# EAGLE schematic PM-BAT v0.4-35X22.86 (EAGLE 9.6.2)
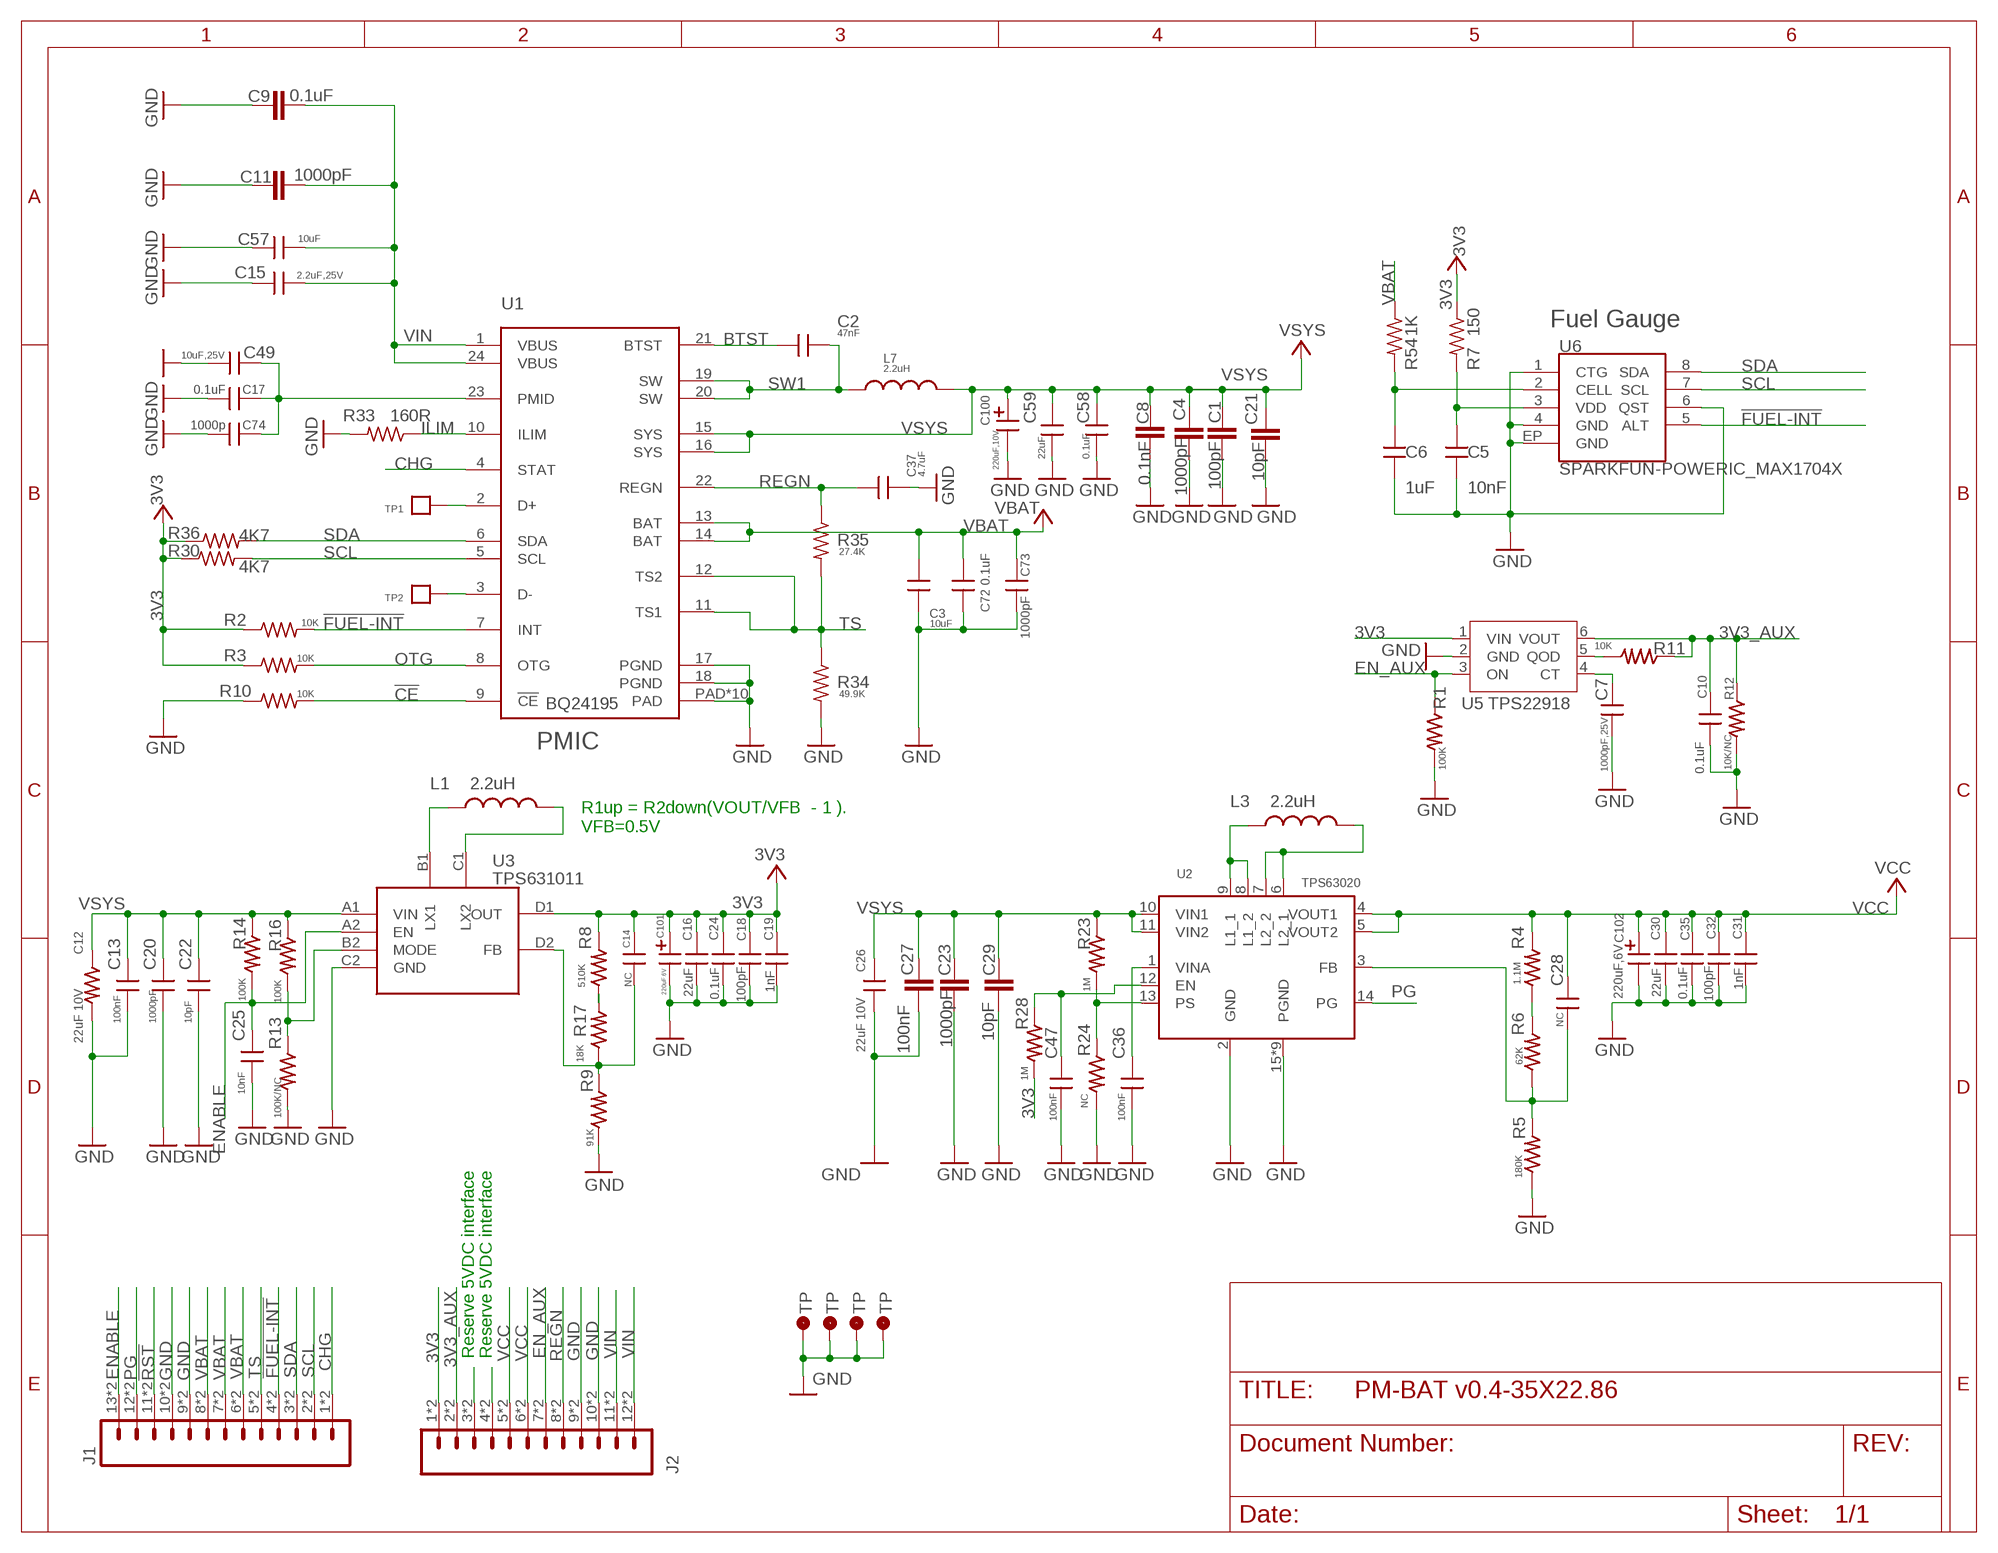
[diagram p0: schematic, sheet 1]

## Parts
C1  100pF  CAP_1  [C0402_B]
C2  47nF  CAP0402  [C-0402]
C3  10uF  CAPC0805  [C0805]
C4  1000pF  CAP_1  [C0402_B]
C5  10nF  CAP0402A  [C0402]
C6  1uF  CAP0402A  [C0402]
C7  1000pF,25V  CAP0402A  [C0402]
C8  0.1nF  CAP_1  [C0402_B]
C9  0.1uF  CAP_1  [C0402_B]
C10  0.1uF  CAPC0201-N  [C0201-N]
C11  1000pF  CAP_1  [C0402_B]
C12  22uF 10V  RESR0603A  [R-0603A]
C13  100nF  CAPC0201-N  [C0201-N]
C14  NC  CAPC0201-N  [C0201-N]
C15  2.2uF,25V  CAP0603A  [C-0603A]
C16  22uF  CAP0603A  [C-0603A]
C17  0.1uF  CAP0402A  [C0402]
C18  100pF  CAP0402A  [C0402]
C19  1nF  CAP0402A  [C0402]
C20  1000pF  CAPC0201-N  [C0201-N]
C21  10pF  CAP_1  [C0402_B]
C22  10pF  CAPC0201-N  [C0201-N]
C23  1000pF  CAP_1  [C0402_B]
C24  0.1uF  CAP0402A  [C0402]
C25  10nF  CAPC0201-N  [C0201-N]
C26  22uF 10V  CAPC0603  [C0603]
C27  100nF  CAP_1  [C0402_B]
C28  NC  CAPC0201-N  [C0201-N]
C29  10pF  CAP_1  [C0402_B]
C30  22uF  CAP0603A  [C-0603A]
C31  1nF  CAP0402A  [C0402]
C32  100pF  CAP0402A  [C0402]
C35  0.1uF  CAP0402A  [C0402]
C36  100nF  CAPC0201-N  [C0201-N]
C37  4.7uF  CAP0402A  [C0402]
C47  100nF  CAPC0201-N  [C0201-N]
C49  10uF,25V  CAP0603A  [C-0603A]
C57  10uF  CAP0603A  [C-0603A]
C58  0.1uF  CAP0402A  [C0402]
C59  22uF  CAPC0603  [C0603]
C72  0.1uF  CAP0402  [C-0402]
C73  1000pF  CAP0402  [C-0402]
C74  1000p  CAP0402  [C-0402]
C100  220uF,10V  CAP-ECASE_B  [CASE-B]
C101  220uF.6V  CAP-ECASE_B  [CASE-B]
C102  220uF,6V  CAP-ECASE_B  [CASE-B]
J1  M13PTH-CST-R  [1X13-CASTELLATED]
J2  M12PTH-CST-R  [1X12-CASTELLATED]
L1  2.2uH  INDUCTOR-SPARKFUNINDUCTOR-2520  [INDUCTOR-2520]
L3  2.2uH  INDUCTOR-SPARKFUNINDUCTOR-2520  [INDUCTOR-2520]
L7  2.2uH  INDUCTORI  [INDUCTOR-4040]
R1  100K  RESR0201-N  [R0201-N]
R2  10K  R-US_  [R0402_B]
R3  10K  R-US_  [R0402_B]
R4  1.1M  RESR0201-N  [R0201-N]
R5  180K  RESR0201-N  [R0201-N]
R6  62K  RESR0201-N  [R0201-N]
R7  150  R-US_  [R0402_B]
R8  510K  RESR0201-N  [R0201-N]
R9  91K  RESR0201-N  [R0201-N]
R10  10K  R-US_  [R0402_B]
R11  10K  RESR0201-N  [R0201-N]
R12  10K/NC  RESR0201-N  [R0201-N]
R13  100K/NC  RESR0201-N  [R0201-N]
R14  100K  RESR0201-N  [R0201-N]
R16  100K  RESR0201-N  [R0201-N]
R17  18K  RESR0201-N  [R0201-N]
R23  1M  RESR0201-N  [R0201-N]
R24  NC  RESR0201-N  [R0201-N]
R28  1M  RESR0201-N  [R0201-N]
R30  4K7  R-US_  [R0402_B]
R33  160R  R-US_  [R0402_B]
R34  49.9K  R-US_  [R0402_B]
R35  27.4K  R-US_  [R0402_B]
R36  4K7  R-US_  [R0402_B]
R54  1K  R-US_  [R0402_B]
TP1  TP1311MM  [TP-1311MM]
TP2  TP1311MM  [TP-1311MM]
U1  BQ24195  ELECTRON_BQ24298RTWR  [ELECTRON_QFN24]
U2  TPS63020  [TPS63020]
U3  TPS631011  TPS631010  [DSBGA]
U5  TPS22918  [SOT-23-6]
U6  SPARKFUN-POWERIC_MAX1704X  [SPARKFUN-POWERIC_TDFN-8]
U$1  TP  [TP_2.33X1.37]
U$2  TP  [TP_2.33X1.37]
U$4  TP  [TP_2.33X1.37]
U$5  TP  [TP_2.33X1.37]

## Nets
3V3: C14.1 C16.1 C18.1 C19.1 C24.1 C101.P$1 J2.1 J2.@1 R2.1 R3.1 R7.1 R8.2 R28.2 R30.1 R36.1 U3.D1(OUT) U5.1(VIN)
3V3_AUX: C10.1 J2.2 J2.@2 R11.1 R12.1 U5.6(VOUT)
!CE: R10.2 U1.9(!CE)
!FUEL-INT: J1.4 J1.@4 R2.2 U1.7(INT) U6.5(ALT)
!RST: J1.11 J1.@11
BTST: C2.1 U1.21(BTST)
CHG: J1.1 J1.@1 U1.4(STAT)
EN_AUX: J2.7 J2.@7 R1.1 U5.3(ON)
ENABLE: C25.1 J1.13 J1.@13 R14.2 U3.A2(EN)
GND: C1.1 C3.2 C4.1 C5.2 C6.2 C7.2 C8.1 C9.1 C10.2 C11.1 C12.2 C13.2 C15.2 C16.2 C17.1 C18.2 C19.2 C20.2 C21.1 C22.2 C23.1 C24.2 C25.2 C26.2 C27.1 C29.1 C30.2 C31.2 C32.2 C35.2 C36.2 C37.2 C47.2 C49.2 C57.2 C58.2 C59.2 C72.2 C73.2 C74.1 C100.P$2 C101.P$2 C102.P$2 J1.9 J1.10 J1.@9 J1.@10 J2.9 J2.10 J2.@9 J2.@10 R1.2 R5.1 R9.1 R10.1 R12.2 R13.2 R24.2 R33.2 R34.2 U1.17(PGND) U1.18(PGND) U1.PAD U1.PAD@1(PAD) U1.PAD@2(PAD) U1.PAD@3(PAD) U1.PAD@4(PAD) U1.PAD@5(PAD) U1.PAD@6(PAD) U1.PAD@7(PAD) U1.PAD@8(PAD) U1.PAD@9(PAD) U2.2(GND) U2.15(PGND) U2.16(PGND) U2.17(PGND) U2.18(PGND) U2.19(PGND) U2.20(PGND) U2.21(PGND) U2.22(PGND) U2.23(PGND) U3.C2(GND) U5.2(GND) U6.1(CTG) U6.4(GND) U6.6(QST) U6.EP(GND) U$1.1(TP) U$2.1(TP) U$4.1(TP) U$5.1(TP)
ILIM: R33.1 U1.10(ILIM)
N$1: J2.3 J2.@3
N$2: C17.2 C49.1 C74.2 U1.23(PMID)
N$4: TP2.P$1 U1.3(D-)
N$5: C14.2 R9.2 R17.1 U3.D2(FB)
N$6: C28.2 R5.2 R6.1 U2.3(FB)
N$7: TP1.P$1 U1.2(D+)
N$8: R8.1 R17.2
N$9: R4.1 R6.2
N$10: J2.4 J2.@4
N$11: L3.1 U2.8(L1_2) U2.9(L1_1)
N$12: L1.1 U3.B1(LX1)
N$15: R13.1 R16.2 U3.B2(MODE)
N$16: L3.2 U2.6(L2_1) U2.7(L2_2)
N$17: L1.2 U3.C1(LX2)
N$18: C7.1 U5.4(CT)
N$19: C36.1 U2.1(VINA)
N$20: R11.2 U5.5(QOD)
N$21: C47.1 R28.1 U2.12(EN)
N$22: R23.2 R24.1 U2.13(PS)
N$48: C5.1 R7.2 U6.3(VDD)
N$49: C6.1 R54.2 U6.2(CELL)
OTG: R3.2 U1.8(OTG)
PG: J1.12 J1.@12 U2.14(PG)
REGN: C37.1 J2.8 J2.@8 R35.1 U1.22(REGN)
SCL: J1.2 J1.@2 R30.2 U1.5(SCL) U6.7(SCL)
SDA: J1.3 J1.@3 R36.2 U1.6(SDA) U6.8(SDA)
SW1: C2.2 L7.P$1 U1.19(SW) U1.20(SW)
TS: J1.5 J1.@5 R34.1 R35.2 U1.11(TS1) U1.12(TS2)
VBAT: C3.1 C72.1 C73.1 J1.6 J1.7 J1.8 J1.@6 J1.@7 J1.@8 R54.1 U1.13(BAT) U1.14(BAT)
VCC: C28.1 C30.1 C31.1 C32.1 C35.1 C102.P$1 J2.5 J2.6 J2.@5 J2.@6 R4.2 U2.4(VOUT1) U2.5(VOUT2)
VIN: C9.2 C11.2 C15.1 C57.1 J2.11 J2.12 J2.@11 J2.@12 U1.1(VBUS) U1.24(VBUS)
VSYS: C1.2 C4.2 C8.2 C12.1 C13.1 C20.1 C21.2 C22.1 C23.2 C26.1 C27.2 C29.2 C58.1 C59.1 C100.P$1 L7.P$2 R14.1 R16.1 R23.1 U1.15(SYS) U1.16(SYS) U2.10(VIN1) U2.11(VIN2) U3.A1(VIN)

## Notes on the sheet
- Fuel Gauge
- PMIC
- R1up = R2down(VOUT/VFB  - 1 ).
  VFB=0.5V
- Reserve 5VDC interface | Reserve 5VDC interface

## Library data of the parts
C1 = Particle:CAP_1; ITEM_NAME: CAP CER 100pF 50V X7R 0402 10%; ITEM_NUMBER: PT-200138
C2 = particle SZ:CAP: CAP; ITEM_NAME: CAP CER 0.1uF 16V X7R 0402 10%; ITEM_NUMBER: PT-200005
C3 C13 C14 C20 C22 C25 C28 C36 C37 C47 C58 C59 = particle SZ:CAP: CAP; ITEM_NAME: CAP CER 10uF 6.3V X5R 0603 10% Low ESR<70mohms; ITEM_NUMBER: PT-200209
C4 C23 = Particle:CAP_1; ITEM_NAME: CAP CER 1000PF 50V X7R 0402 10%
C5 = particle SZ:CAP: CAP; ITEM_NAME: CAP CER 10nF 16V X5R 0402 10%; ITEM_NUMBER: PT-200136
C6 = particle SZ:CAP: CAP; ITEM_NAME: CAP CER X5R 1uF 0402 10V ±10% ROHS; ITEM_NUMBER: PT-200695
C7 C15 C49 C57 = particle SZ:CAP: CAP; ITEM_NAME: CAP CER 100PF 50V C0G/NP0 0603 5%; ITEM_NUMBER: PT-200458
C8 C27 = Particle:CAP_1; ITEM_NAME: CAP CER 0.1UF 16V X7R 0402 10%; ITEM_NUMBER: PT-200649
C9 = Particle:CAP_1; ITEM_NAME: CAP CER 0.1UF 25V X7R 0402 20%; ITEM_NUMBER: PT-200690
C10 C24 C35 = particle SZ:CAP: CAP; ITEM_NAME: 0.1UF 16V X7R 0402 10%; ITEM_NUMBER: PT-200649
C11 = Particle:CAP_1; ITEM_NAME: CAP CER 1000PF 50V X7R 0402 10%; ITEM_NUMBER: PT-200631
C12 = particle SZ:RES: RES; ITEM_NAME: CAP CER 0.1UF 16V X7R 0402 10%; ITEM_NUMBER: 120-00060
C16 C30 = particle SZ:CAP: CAP; ITEM_NAME: CAP CER 22UF 10V X5R 0603 20%; ITEM_NUMBER: 120-00061
C17 = RedBear:CAP: CAP; ITEM_NAME: CAP CER 0.1UF 25V X7R 0402 20%; ITEM_NUMBER: PT-200690
C18 C32 = particle SZ:CAP: CAP; ITEM_NAME: 100pF 50V X7R 0402 10%; ITEM_NUMBER: PT-200138
C19 C31 C73 = particle SZ:CAP: CAP; ITEM_NAME: 1000PF 50V X7R 0402 10%; ITEM_NUMBER: PT-200631
C21 C29 = Particle:CAP_1; ITEM_NAME: CAP CER 10PF 5% 50V C0G/NP0 0402; ITEM_NUMBER: 120-00038
C26 = particle SZ:CAP: CAP; ITEM_NAME: CAP CER 0.1UF 16V X7R 0402 10%; ITEM_NUMBER: 120-00060
C72 = particle SZ:CAP: CAP; ITEM_NAME: CAP CER 0.1UF 16V X7R 0402 10%; ITEM_NUMBER: PT-200649
C74 = particle SZ:CAP: CAP; ITEM_NAME: CAP CER 1000PF 50V X7R 0402 10%; ITEM_NUMBER: PT-200631
C100-C102 = particle SZ:CAP-E
J1 = Particle:M13PTH-CST-R
J2 = Particle:M12: Header 12 Standard 12-pin 0.1" header. Use with straight break away headers (SKU : PRT-00116), right angle break away headers (PRT-00553), swiss pins (PRT-00743), machine pins (PRT-00117), and female headers (PRT-00115).
L1 L3 = Particle:INDUCTOR-SPARKFUN: Inductors Basic Inductor/Choke - 0603 and 1206. Footprints are not proven and vary greatly between part numbers. SRN6045- 33uH, 20% 1.4A
L7 = Particle:INDUCTOR; ITEM_NAME: FIXED IND 1UH 5.8A 26 MOHM SMD 4020; ITEM_NUMBER: 155-00005
R1 R8 R13 R14 R16 R23 = particle SZ:RES: RES; ITEM_NAME: RES SMD 1M OHM 1% 1/16W 0402; ITEM_NUMBER: PT-201084
R2 R3 R10 = Spark:R-US_: 0402 Resistor; ITEM_NAME: 10K OHM 5% 1/16W 0402; ITEM_NUMBER: PT-200004
R4-R6 R9 R24 R28 = particle SZ:RES: RES
R7 R33 = Particle:R-US_: 0402 Resistor
R11 R12 = particle SZ:RES: RES; ITEM_NAME: 10K OHM 5% 1/16W 0402; ITEM_NUMBER: PT-200004
R17 = particle SZ:RES: RES; ITEM_NAME: RES SMD 24K OHM 1% 1/16W 0402; ITEM_NUMBER: PT-201025
R30 R36 = Particle:R-US_: 0402 Resistor; ITEM_NAME: RES SMD 4K7 OHM 5% 1/16W 0402; ITEM_NUMBER: PT-200230
R34 R35 = Spark:R-US_: 0402 Resistor
R54 = Particle:R-US_: 0402 Resistor; ITEM_NAME: RES SMD 1K OHM 5% 1/16W 0402; ITEM_NUMBER: PT-200002
TP1 TP2 = particle SZ:TP
U1 = ELEKTRA-PMIC v0.3-35X22.86-0.8-0402:ELECTRON_BQ24298RTWR: Bq24298 I2C Controlled 3A Single Cell USB Charger with Narrow VDC Power Path Management and Adjustable Voltage USB OTG
U2 = particle SZ:TPS63020
U3 = particle SZ:TPS631010
U5 = particle SZ:TPS22918
U6 = ELEKTRA-PMIC v0.3-35X22.86-0.8-0402:SPARKFUN-POWERIC_MAX1704X: MAX17043/MAX17044: Battery Fuel Guage (43 is 1cell, 44 is 2cell)
U$1 U$2 U$4 U$5 = Particle:TP: Test Points of all sizes and shapes

## Net classes
0 default: width 0.152 mm, drill 0.203 mm, clearance 0.152 mm
1 power: width 0.305 mm, drill 0.203 mm, clearance 0.203 mm
3 BAT: drill 0.203 mm, clearance 0.203 mm
4 3V3: width 0.305 mm, drill 0.203 mm, clearance 0.508 mm
6 +3V3: width 0.203 mm, drill 0.203 mm, clearance 0.152 mm